# Altium schematic sheet Cookie Connector.schdoc
size A4
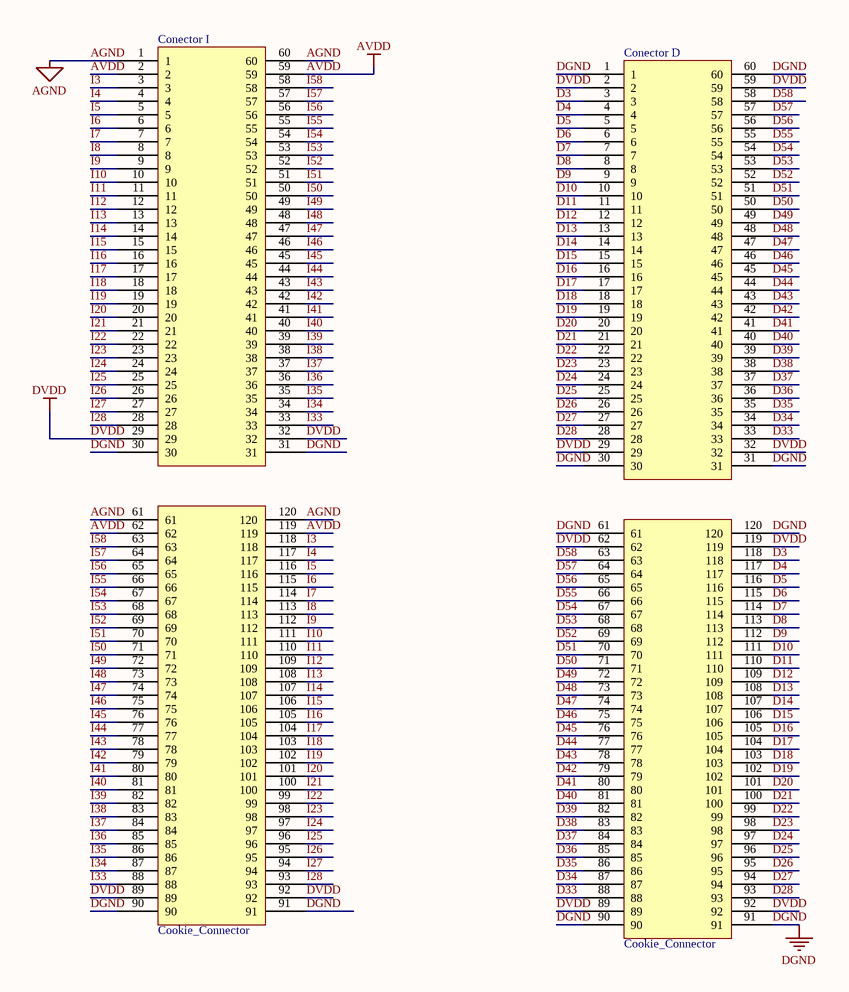
[diagram p0: Cookie Connector.schdoc]

## Parts
Conector_D  Cookie_Connector  [COOKIECON_HEADER_AND_SOCKET]
Conector_I  Cookie_Connector  [COOKIECON_HEADER_AND_SOCKET]

## Nets
AGND: Conector_I.1 Conector_I.60 Conector_I.61 Conector_I.120
AVDD: Conector_I.2 Conector_I.59 Conector_I.62 Conector_I.119
DGND: Conector_D.1 Conector_D.30 Conector_D.31 Conector_D.60 Conector_D.61 Conector_D.90 Conector_D.91 Conector_D.120 Conector_I.30 Conector_I.31 Conector_I.90 Conector_I.91
DVDD: Conector_D.2 Conector_D.29 Conector_D.32 Conector_D.59 Conector_D.62 Conector_D.89 Conector_D.92 Conector_D.119 Conector_I.29 Conector_I.32 Conector_I.89 Conector_I.92
D3: Conector_D.3 Conector_D.118
D4: Conector_D.4 Conector_D.117
D5: Conector_D.5 Conector_D.116
D6: Conector_D.6 Conector_D.115
D7: Conector_D.7 Conector_D.114
D8: Conector_D.8 Conector_D.113
D9: Conector_D.9 Conector_D.112
D10: Conector_D.10 Conector_D.111
D11: Conector_D.11 Conector_D.110
D12: Conector_D.12 Conector_D.109
D13: Conector_D.13 Conector_D.108
D14: Conector_D.14 Conector_D.107
D15: Conector_D.15 Conector_D.106
D16: Conector_D.16 Conector_D.105
D17: Conector_D.17 Conector_D.104
D18: Conector_D.18 Conector_D.103
D19: Conector_D.19 Conector_D.102
D20: Conector_D.20 Conector_D.101
D21: Conector_D.21 Conector_D.100
D22: Conector_D.22 Conector_D.99
D23: Conector_D.23 Conector_D.98
D24: Conector_D.24 Conector_D.97
D25: Conector_D.25 Conector_D.96
D26: Conector_D.26 Conector_D.95
D27: Conector_D.27 Conector_D.94
D28: Conector_D.28 Conector_D.93
D33: Conector_D.33 Conector_D.88
D34: Conector_D.34 Conector_D.87
D35: Conector_D.35 Conector_D.86
D36: Conector_D.36 Conector_D.85
D37: Conector_D.37 Conector_D.84
D38: Conector_D.38 Conector_D.83
D39: Conector_D.39 Conector_D.82
D40: Conector_D.40 Conector_D.81
D41: Conector_D.41 Conector_D.80
D42: Conector_D.42 Conector_D.79
D43: Conector_D.43 Conector_D.78
D44: Conector_D.44 Conector_D.77
D45: Conector_D.45 Conector_D.76
D46: Conector_D.46 Conector_D.75
D47: Conector_D.47 Conector_D.74
D48: Conector_D.48 Conector_D.73
D49: Conector_D.49 Conector_D.72
D50: Conector_D.50 Conector_D.71
D51: Conector_D.51 Conector_D.70
D52: Conector_D.52 Conector_D.69
D53: Conector_D.53 Conector_D.68
D54: Conector_D.54 Conector_D.67
D55: Conector_D.55 Conector_D.66
D56: Conector_D.56 Conector_D.65
D57: Conector_D.57 Conector_D.64
D58: Conector_D.58 Conector_D.63
I3: Conector_I.3 Conector_I.118
I4: Conector_I.4 Conector_I.117
I5: Conector_I.5 Conector_I.116
I6: Conector_I.6 Conector_I.115
I7: Conector_I.7 Conector_I.114
I8: Conector_I.8 Conector_I.113
I9: Conector_I.9 Conector_I.112
I10: Conector_I.10 Conector_I.111
I11: Conector_I.11 Conector_I.110
I12: Conector_I.12 Conector_I.109
I13: Conector_I.13 Conector_I.108
I14: Conector_I.14 Conector_I.107
I15: Conector_I.15 Conector_I.106
I16: Conector_I.16 Conector_I.105
I17: Conector_I.17 Conector_I.104
I18: Conector_I.18 Conector_I.103
I19: Conector_I.19 Conector_I.102
I20: Conector_I.20 Conector_I.101
I21: Conector_I.21 Conector_I.100
I22: Conector_I.22 Conector_I.99
I23: Conector_I.23 Conector_I.98
I24: Conector_I.24 Conector_I.97
I25: Conector_I.25 Conector_I.96
I26: Conector_I.26 Conector_I.95
I27: Conector_I.27 Conector_I.94
I28: Conector_I.28 Conector_I.93
I33: Conector_I.33 Conector_I.88
I34: Conector_I.34 Conector_I.87
I35: Conector_I.35 Conector_I.86
I36: Conector_I.36 Conector_I.85
I37: Conector_I.37 Conector_I.84
I38: Conector_I.38 Conector_I.83
I39: Conector_I.39 Conector_I.82
I40: Conector_I.40 Conector_I.81
I41: Conector_I.41 Conector_I.80
I42: Conector_I.42 Conector_I.79
I43: Conector_I.43 Conector_I.78
I44: Conector_I.44 Conector_I.77
I45: Conector_I.45 Conector_I.76
I46: Conector_I.46 Conector_I.75
I47: Conector_I.47 Conector_I.74
I48: Conector_I.48 Conector_I.73
I49: Conector_I.49 Conector_I.72
I50: Conector_I.50 Conector_I.71
I51: Conector_I.51 Conector_I.70
I52: Conector_I.52 Conector_I.69
I53: Conector_I.53 Conector_I.68
I54: Conector_I.54 Conector_I.67
I55: Conector_I.55 Conector_I.66
I56: Conector_I.56 Conector_I.65
I57: Conector_I.57 Conector_I.64
I58: Conector_I.58 Conector_I.63